# Altium schematic sheet POWER.SchDoc
size B
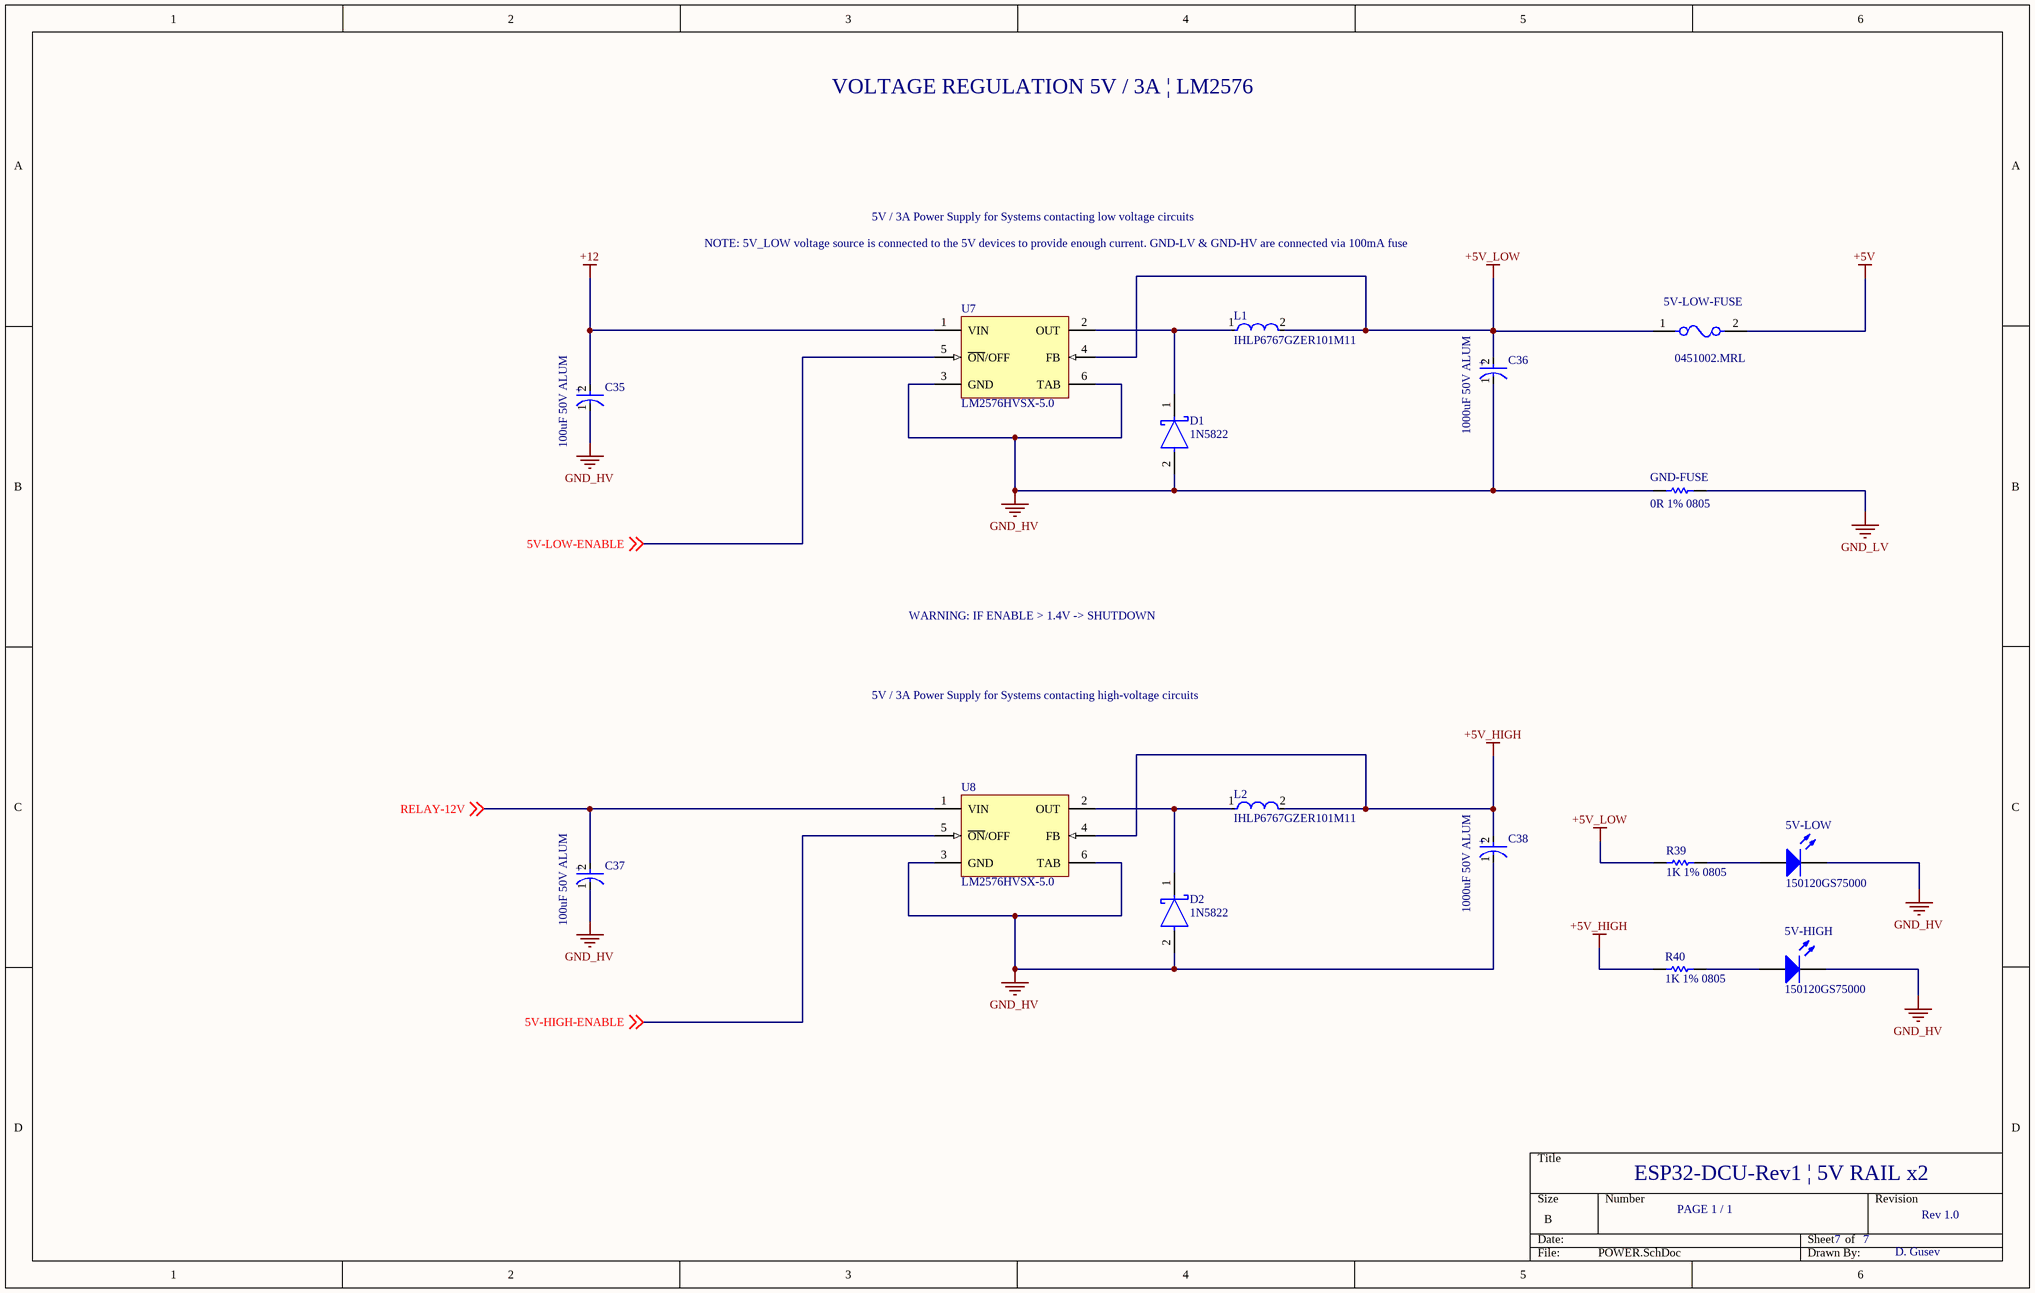
[diagram p0: POWER.SchDoc]

## Parts
5V-HIGH  150120GS75000  [1206_A]
5V-LOW  150120GS75000  [1206_A]
5V-LOW-FUSE  0451002.MRL  [FP-0451-MFG]
C35  100uF 50V ALUM  [FP-EEE-FK1H101P-MFG]
C36  1000uF 50V ALUM  [FP-FK-J16-MFG]
C37  100uF 50V ALUM  [FP-EEE-FK1H101P-MFG]
C38  1000uF 50V ALUM  [FP-FK-J16-MFG]
D1  1N5822  [FP-DO-201AD-MFG]
D2  1N5822  [FP-DO-201AD-MFG]
GND-FUSE  0R 1% 0805  [RESC2013X60X35ML10T20]
L1  IHLP6767GZER101M11  [FP-IHLP-6767GZ-FP_3_825x1-MFG]
L2  IHLP6767GZER101M11  [FP-IHLP-6767GZ-FP_3_825x1-MFG]
R39  1K 1% 0805  [RESC2013X60X40ML20T25]
R40  1K 1% 0805  [RESC2013X60X40ML20T25]
U7  LM2576HVSX-5.0  [KTT0005B_L]
U8  LM2576HVSX-5.0  [KTT0005B_L]

## Nets
+5V: 5V-LOW-FUSE.2
+5V_HIGH: C38.2(A) L2.2 R40.2 U8.4(FB)
+5V_LOW: 5V-LOW-FUSE.1 C36.2(A) L1.2 R39.2 U7.4(FB)
+12: C35.2(A) U7.1(VIN)
GND_HV: 5V-HIGH.1(K) 5V-LOW.1(K) C35.1(C) C36.1(C) C37.1(C) C38.1(C) D1.2(A) D2.2(A) GND-FUSE.1 U7.3(GND) U7.6(TAB) U8.3(GND) U8.6(TAB)
GND_LV: GND-FUSE.2
5V-HIGH-ENABLE: U8.5(~{ON}/OFF) ; off-sheet 5V-HIGH-ENABLE
5V-LOW-ENABLE: U7.5(~{ON}/OFF) ; off-sheet 5V-LOW-ENABLE
RELAY-12V: C37.2(A) U8.1(VIN) ; off-sheet RELAY-12V
Net5V-HIGH_2: 5V-HIGH.2(A) R40.1
Net5V-LOW_2: 5V-LOW.2(A) R39.1
NetD1_1: D1.1(C) L1.1 U7.2(OUT)
NetD2_1: D2.1(C) L2.1 U8.2(OUT)

## Notes on the sheet
- VOLTAGE REGULATION 5V / 3A | LM2576
- 5V / 3A Power Supply for Systems contacting low voltage circuits
- NOTE: 5V_LOW voltage source is connected to the 5V devices to provide enough current. GND-LV & GND-HV are connected via 100mA fuse
- WARNING: IF ENABLE > 1.4V -> SHUTDOWN
- 5V / 3A Power Supply for Systems contacting high-voltage circuits
- ESP32-DCU-Rev1 | 5V RAIL x2
- PAGE 1 / 1
- 7
- Rev 1.0
- D. Gusev
- (in symbol CMP-2000-06208-2) +
- (in symbol CMP-05427-000011-1) +

## Library data of the parts
5V-HIGH 5V-LOW = CMP-1426-00014-1: SMD mono-color Chip LED, WL-SMCW, Green; Manufacturer: Wuerth Elektronik; PackageReference: 1206_A; PartNumber: 150120GS75000; ComponentLink1Description: Manufacturer URL; ComponentLink2URL: http://katalog.we-online.com/led/datasheet/150120GS75000.pdf; ComponentLink2Description: Datasheet; Color: Green; ComponentLink1URL: http://www.we-online.com
5V-LOW-FUSE = CMP-08605-000053-1: FUSE BOARD MNT 2A 125VAC/VDC SMD; Manufacturer: Littelfuse; Max Fuse Dc Voltage: 125V; Value: 0.0367Ω; Fuse Interrupt Ac Current: 50A; Fuse I2T: 0.53A2Sec; Fuse Blow Speed: Fast; Device Class L2: Fuses; Temperature Range High: +125°C; Category: Fuse; ComponentLink2URL: https://www.littelfuse.com/~/media/electronics/datasheets/fuses/littelfuse_fuse_451_453_datasheet.pdf.pdf; Automotive: No; Temperature Range Low: -55°C; Voltage Rating: 125V; ComponentLink2Description: Datasheet; Temperature: -55°C to +125°C; Device Class L3: unset; Height: 2.94mm; Lead Free: Yes; Resistance: 0.0367Ω; Max Fuse Ac Voltage: 125V; Fuse Interrupt Dc Current: 50A; RoHS: TRUE; Fuse Current: 2A; Digikey Description: FUSE BOARD MNT 2A 125VAC/VDC SMD; Device Class L1: Circuit Protection; Octopart: https://octopart.com/0451002.mrl-littelfuse-566376; Mouser Description: Surface Mount Fuses 125V 2A; Package: 0451; Manufacturer Part Number: 0451002.MRL
C35 C37 = CMP-2000-06208-2: CAP ALUM 100UF 20% 50V SMD; Manufacturer Part Number: EEE-FK1H101P; Manufacturer: Panasonic Electronic Components; Automotive Grade: Grade 2; Dissipation Factor: 10%; Life: 2000Hours; Ripple Current: 350mA; Material: Aluminum; Esr: 0.34Ω; Leakage Current: 50uA; Tolerance: 20%; Package: 0; ComponentLink2URL: https://industrial.panasonic.com/cdbs/www-data/pdf/RDE0000/ABA0000C1181.pdf; Temperature Range Low: -55°C; Voltage Rating: 50V; ComponentLink2Description: Datasheet; Category: Cap; Digikey Description: CAP ALUM 100UF 20% 50V SMD; Octopart: https://octopart.com/eeefk1h101p-panasonic-4642841; Automotive: Yes; Temperature: -55°C to +105°C; Capacitance: 100uF; Lead Free: Yes; Mouser Description: Cap Aluminum Lytic 100uF 50V 20% (8 X 10.2mm) SMD 350mA 2000h 105C Automotive T/R; Height: 10.5mm; Device Class L3: Aluminum Electrolytic Capacitors; Value: 100uF; Device Class L1: Passive Components; RoHS: TRUE; Device Class L2: Capacitors; Temperature Range High: +105°C
C36 C38 = CMP-05427-000011-1: CAP ALUM 1000UF 20% 50V SMD; Manufacturer Part Number: EEV-FK1H102M; Manufacturer: Panasonic Electronic Components; Esr: 0.073Ω; Life: 2000Hours; Leakage Current: 500uA; Ripple Current: 1610mA; Dissipation Factor: 10%; Automotive Grade: Grade 2; Material: Aluminum; Capacitance: 1000uF; Tolerance: 20%; Device Class L1: Passive Components; Temperature: -55°C to +105°C; Device Class L2: Capacitors; Mouser Description: Cap Aluminum Lytic 1000uF 50V 20% (16 X 16.5mm) SMD 0.073 Ohm 1610mA 2000h 105C Automotive T/R; Category: Cap; Digikey Description: CAP ALUM 1000UF 20% 50V SMD; Value: 1000uF; Lead Free: Yes; Octopart: https://octopart.com/eev-fk1h102m-panasonic-39480688; Temperature Range High: +105°C; Package: FK-J16; Device Class L3: Aluminum Electrolytic Capacitors; ComponentLink2Description: Datasheet; RoHS: TRUE; Height: 17mm; ComponentLink2URL: https://b2b-api.panasonic.eu/file_stream/pids/fileversion/3127; Voltage Rating: 50V; Temperature Range Low: -55°C; Automotive: Yes
D1 D2 = CMP-12187-000025-1: DIODE SCHOTTKY 40V 3A DO201AD; Manufacturer: STMicroelectronics; Max Junction Temp: +150°C; Peak Reverse Current: 2mA; Max Surge Forward Current: 80A; Temperature Range High: +150°C; Automotive: No; RoHS: TRUE; ComponentLink2Description: Datasheet; Manufacturer Part Number: 1N5822; Lead Free: Yes; Octopart: https://octopart.com/1n5822-stmicroelectronics-323225; Device Class L2: Diodes; Max Repetitive Reverse Voltage: 40V; Temperature: to +150°C; Height: 5.3mm; Category: Diode; Digikey Description: DIODE SCHOTTKY 40V 3A DO201AD; ComponentLink2URL: https://www.st.com/resource/en/datasheet/1n5822.pdf; Device Class L3: Schottky Diodes; Device Class L1: Discrete Semiconductors; Forward Current: 3A; Mouser Description: Schottky Diodes & Rectifiers Vr/40V Io/3A BULK; Package: DO-201AD
GND-FUSE = CMP-2100-03673-1: Chip Resistor, 0 Ohm, Jumper, +/- 5%, 0.125 W, -55 to 155 degC, 0805 (2012 Metric), RoHS, Tape and Reel; Manufacturer: Yageo; Power Rating: 125mW; Resistance: 0mOhm; Voltage Rating (DC): 150V; Temperature Coefficient: 200ppm/degreesC; Height: 0.5mm; Depth: 1.25mm; Case Code (Imperial): 0805; Lead Free: LeadFree; Military Standard: Not; Package Description: 2-Pin Surface Mounted Device, Body 2 x 1.25 mm; Case Code (Metric): 2012; Composition: ThickFilm; Voltage Rating: 150V; Manufacturer URL: http://www.yageo.com/; Packaging: TapeandReel; Package Reference: 0805; REACH SVHC: Unknown; Tolerance: 5%; Case/Package: 0805; Max Operating Temperature: 155degC; Number of Pins: 2; Min Operating Temperature: -55degC; RoHSCompliant: true; Length: 2mm; Datasheet URL: http://www.yageo.com/NewPortal/yageodocoutput?fileName=/pdf/R-Chip/PYu-RC_Group_51_RoHS_L_5.pdf; Termination: SMD/SMT; Radiation Hardening: No; Width: 1.25mm; Contact Plating: Tin; Datasheet Version: Rev. 5, 10/2016
L1 L2 = CMP-02424-000256-1: Commercial Inductors, Low DCR Series 100uH 5A 110mΩ 20%; DC Resistance (DCR): 110mR; Saturation Current: 4A; Test Frequency: 100kHz; Core Material: Metal; Self Resonant Frequency: 2.1MHz; Shielding: Shielded; Number of Pins: 2; Termination: SMD/SMT; Case/Package: 6767; Package Quantity: 200; Max Operating Temperature: 125°C; Max DC Current: 4A; Min Operating Temperature: -55°C; Military Standard: Not; Height: 7mm; Tolerance: 20%; Width: 0.675inch; Radiation Hardening: No; Current Rating: 5A; Depth: 17.15mm; RMS Current (Irms): 5A; Mount: Surface Mount; Height - Seated (Max): 0.276inch; Length: 17.15mm; Inductance: 100uH; Inductance Tolerance: 20%; Lead Free: Lead Free; Packaging: Tape and Reel
R39 R40 = CMP-2001-00590-1: Part Number: ERA6AEB123V; Manufacturer: Panasonic
U7 U8 = CMP-0069-00141-3: SIMPLE SWITCHER® 3A Step-Down Voltage Regulator, 5-pin TO-263; Manufacturer: Texas Instruments; PackageTopMarking: NSUZXYTTE#*LM2576*HVS-5.0 P+; PowerWise: N; RoHS: N; PackageDescription: TO-263, Molded, .400 x .390 x .180in, 5 Lead, .067in Pitch, Surface Mount; Code_JEDEC: MO-169-AB; CompType: Switcher; ComponentLink1URL: http://www.ti.com/general/docs/lit/getliterature.tsp?genericPartNumber=LM2576HV&fileType=pdf; ComponentLink1Description: Datasheet URL; PinCount: 5; PackageReference: KTT0005B